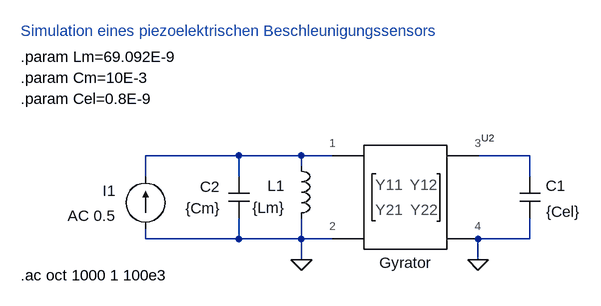
[diagram p0: schematic Beschleunigungssensor.asc]
Beschleunigungssensor.asc, the LTspice schematic file:
Version 4
SHEET 1 880 680
WIRE -48 128 -192 128
WIRE 48 128 -48 128
WIRE 96 128 48 128
WIRE 400 128 320 128
WIRE 48 144 48 128
WIRE -192 160 -192 128
WIRE -48 160 -48 128
WIRE 400 160 400 128
WIRE -192 256 -192 240
WIRE -48 256 -48 224
WIRE -48 256 -192 256
WIRE 48 256 48 224
WIRE 48 256 -48 256
WIRE 96 256 48 256
WIRE 400 256 400 224
WIRE 400 256 320 256
WIRE 48 288 48 256
WIRE 320 288 320 256
FLAG 48 288 0
FLAG 320 288 0
SYMBOL ind 32 128 R0
WINDOW 0 -36 46 Left 2
WINDOW 3 -59 80 Left 2
SYMATTR InstName L1
SYMATTR Value {Lm}
SYMATTR SpiceLine Rser=0
SYMBOL cap 384 160 R0
WINDOW 0 40 14 Left 2
WINDOW 3 41 54 Left 2
SYMATTR InstName C1
SYMATTR Value {Cel}
SYMBOL cap -64 160 R0
WINDOW 0 -44 16 Left 2
WINDOW 3 -66 49 Left 2
SYMATTR InstName C2
SYMATTR Value {Cm}
SYMBOL current -192 240 R180
WINDOW 123 46 20 Left 2
WINDOW 39 0 0 Left 2
WINDOW 0 46 58 Left 2
WINDOW 3 37 114 Left 2
SYMATTR Value2 AC 0.5
SYMATTR InstName I1
SYMATTR Value ""
SYMBOL Mechatronik\\Wandler\\Gyrator 208 176 R0
SYMATTR InstName U2
SYMATTR Value Y11=1E-20
SYMATTR Value2 Y12=0.522174
SYMATTR SpiceLine Y21=Y12
SYMATTR SpiceLine2 Y22=1E-20
TEXT -384 312 Left 2 !.ac oct 1000 1 100e3
TEXT -384 -24 Left 2 !.param Lm=69.092E-9
TEXT -384 8 Left 2 !.param Cm=10E-3
TEXT -384 40 Left 2 !.param Cel=0.8E-9
TEXT -384 -64 Left 2 ;Simulation eines piezoelektrischen Beschleunigungssensors

The netlist it stands for:
* Beschleunigungssensor.asc
L1 N001 0 {Lm} Rser=0
C1 N002 0 {Cel}
C2 N001 0 {Cm}
I1 0 N001 AC 0.5
XU2 N001 0 N002 0 Gyrator Y11=1E-20 Y12=0.522174 Y21=Y12 Y22=1E-20  ; pins 1 2 3 4
.ac oct 1000 1 100e3
.param Lm=69.092E-9
.param Cm=10E-3
.param Cel=0.8E-9
* Simulation eines piezoelektrischen Beschleunigungssensors
.lib Mechatronik.lib
.backanno
.end